# EAGLE schematic arduino-nano (EAGLE 9.6.2)
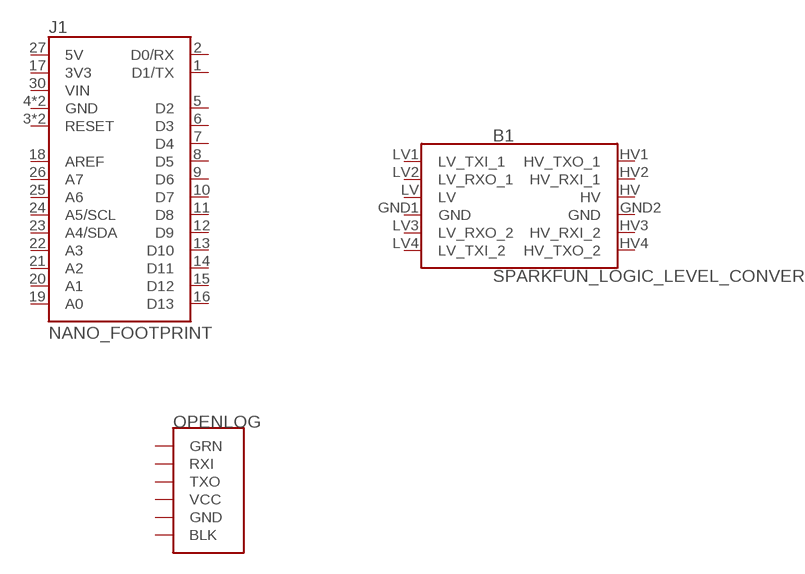
[diagram p0: schematic, sheet 1]

## Parts
B1  SPARKFUN_LOGIC_LEVEL_CONVERTER  [SPARKFUN_LOGIC_LEVEL_CONVERTER]
J1  NANO_FOOTPRINT  [NANO]
U$1  OPENLOG  [OPENLOG]
Unconnected: B1.HV1(HV_TXO_1) B1.HV2(HV_RXI_1) B1.HV3(HV_RXI_2) B1.HV4(HV_TXO_2) B1.LV1(LV_TXI_1) B1.LV2(LV_RXO_1) B1.LV3(LV_RXO_2) B1.LV4(LV_TXI_2) J1.1(D1/TX) J1.2(D0/RX) J1.3(RESET) J1.4(GND) J1.5(D2) J1.6(D3) J1.7(D4) J1.8(D5) J1.9(D6) J1.10(D7) J1.11(D8) J1.12(D9) J1.13(D10) J1.14(D11) J1.15(D12) J1.16(D13) J1.17(3V3) J1.18(AREF) J1.19(A0) J1.20(A1) J1.21(A2) J1.22(A3) J1.23(A4/SDA) J1.24(A5/SCL) J1.25(A6) J1.26(A7) J1.27(5V) J1.28(RESET) J1.29(GND) J1.30(VIN) U$1.BLK U$1.GRN U$1.RXI U$1.TXO

## Power pins joined to a net without a drawn wire
GND: B1.GND1(GND) B1.GND2(GND) U$1.GND
HV: B1.HV
LV: B1.LV
VCC: U$1.VCC

## Library data of the parts
B1 = SparkFun-Boards:SPARKFUN_LOGIC_LEVEL_CONVERTER: SparkFun Logic Level Converter -Bi-Directional This is the mechnical outline for the 3.3V - 5V bi directional logic level converter. *Note, the "LOCK" Package has the header pins staggered by an offset of 5 mils (off center line), so that when you slide a row of standard 0.1" headers into the PTH pads, it will hold position vertically. See the follwing turorial for more information on this type of special footprints: Sneaky Footprints <https://www.sparkfun.com/tutorials/114> SparkFun Products: SparkFun Logic Level Converter - Bi-Directional <https://www.sparkfun.com/products/12009>
J1 = SparkFun-Boards:NANO_FOOTPRINT: Generic Nano Footprint
U$1 = SparkFun-Boards:OPENLOG

## Net classes
1 vcc: width 0.203 mm